# Altium schematic sheet Sheet2_COM.SchDoc
size A3; SheetNumber: 2; SheetTotal: 2
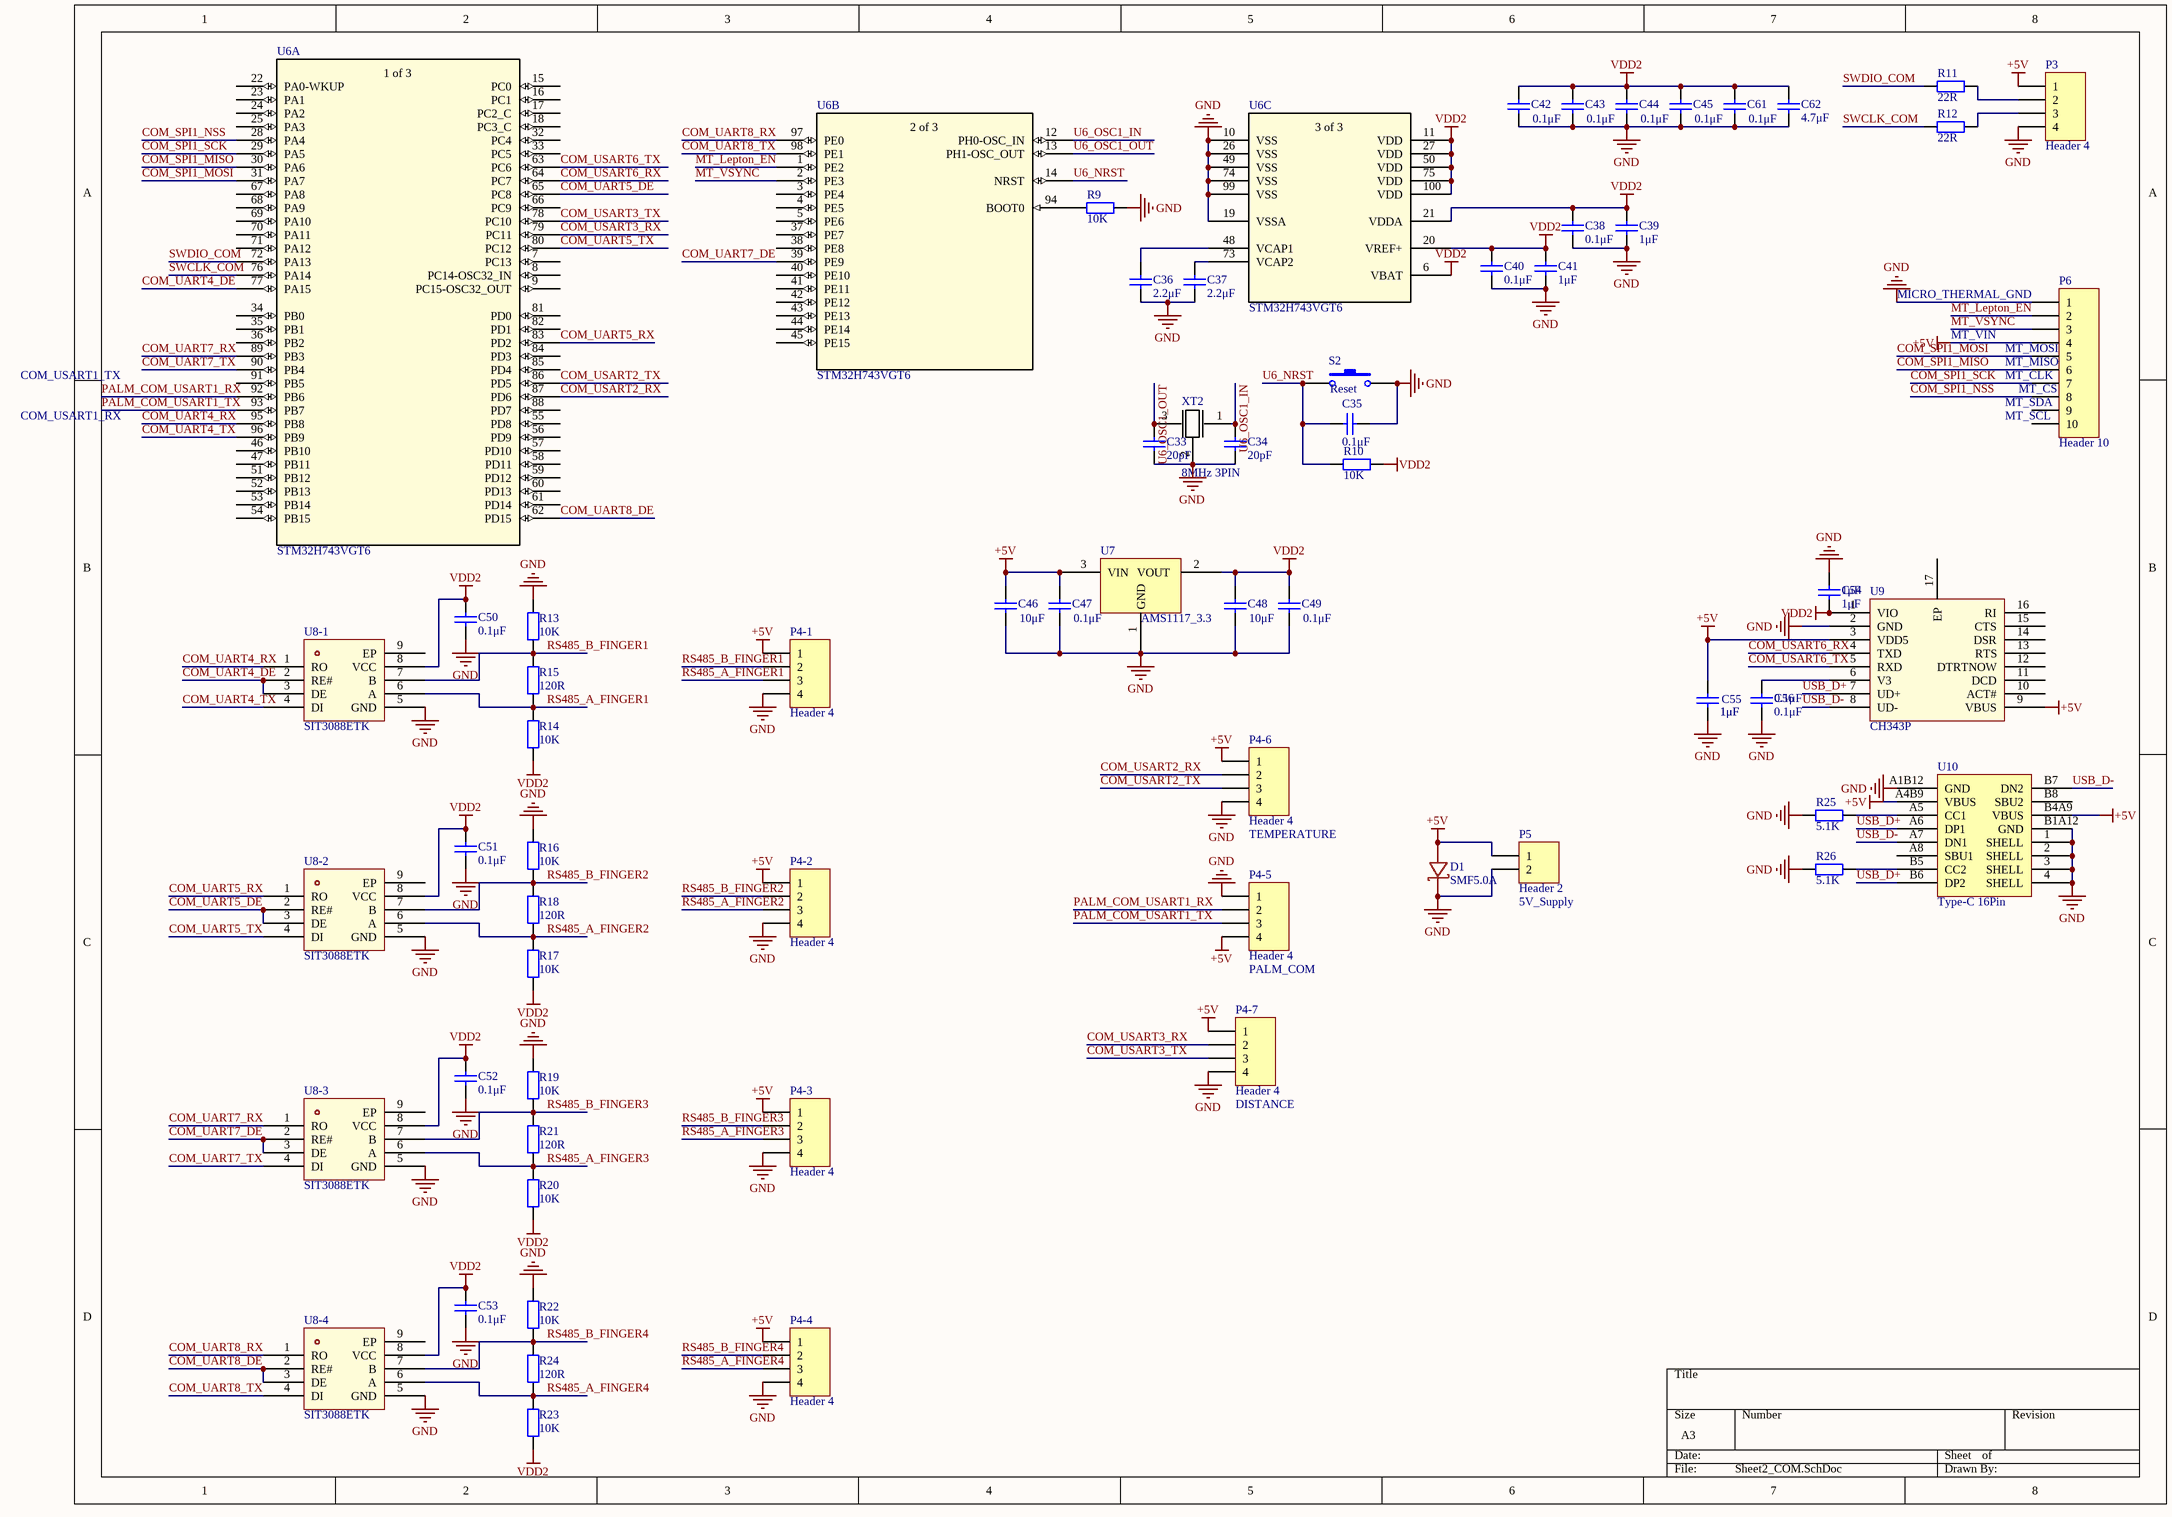
[diagram p0: Sheet2_COM.SchDoc]

## Parts
C33  20pF  [C0402]
C34  20pF  [C0402]
C35  0.1μF  [C0402]
C36  2.2μF  [C0402]
C37  2.2μF  [C0402]
C38  0.1μF  [C0402]
C39  1μF  [C0402]
C40  0.1μF  [C0402]
C41  1μF  [C0402]
C42  0.1μF  [C0402]
C43  0.1μF  [C0402]
C44  0.1μF  [C0402]
C45  0.1μF  [C0402]
C46  10μF  [C0402]
C47  0.1μF  [C0402]
C48  10μF  [C0402]
C49  0.1μF  [C0402]
C50  0.1μF  [C0402]
C51  0.1μF  [C0402]
C52  0.1μF  [C0402]
C53  0.1μF  [C0402]
C54  1μF  [C0402]
C55  1μF  [C0402]
C56  0.1μF  [C0402]
C61  0.1μF  [C0402]
C62  4.7μF  [C0402]
D1  SMF5.0A  [SOD-123FL_L2.7-W1.8-LS3.8-RD]
P3  Header 4  [CONN-SMD_XDWF-0910-04P]
P4-1  Header 4  [CONN-SMD_XDWF-0910-04P]
P4-2  Header 4  [CONN-SMD_XDWF-0910-04P]
P4-3  Header 4  [CONN-SMD_XDWF-0910-04P]
P4-4  Header 4  [CONN-SMD_XDWF-0910-04P]
P4-5  Header 4  [HDR1X4]
P4-6  Header 4  [CONN-SMD_XDWF-0910-04P]
P4-7  Header 4  [CONN-SMD_XDWF-0910-04P]
P5  Header 2  [CONN-SMD_2060-452]
P6  Header 10  [FPC-SMD_10P-P0.50_HCTL_HC-FPC-05-10-10RLTAG]
R9  10K  [R0402]
R10  10K  [R0402]
R11  22R  [R0402]
R12  22R  [R0402]
R13  10K  [R0402]
R14  10K  [R0402]
R15  120R  [R0402]
R16  10K  [R0402]
R17  10K  [R0402]
R18  120R  [R0402]
R19  10K  [R0402]
R20  10K  [R0402]
R21  120R  [R0402]
R22  10K  [R0402]
R23  10K  [R0402]
R24  120R  [R0402]
R25  5.1K  [R0402]
R26  5.1K  [R0402]
S2  Reset  [SW-SMD_L3.9-W3.0-P4.45]
U6  STM32H743VGT6  [LQFP100-14x14mm]  (parts A,B,C of 3)
U7  AMS1117_3.3  [AMS1117-3.3]
U8-1  SIT3088ETK  [DFN-8_L3.0-W3.0-P0.65-BL-EP]
U8-2  SIT3088ETK  [DFN-8_L3.0-W3.0-P0.65-BL-EP]
U8-3  SIT3088ETK  [DFN-8_L3.0-W3.0-P0.65-BL-EP]
U8-4  SIT3088ETK  [DFN-8_L3.0-W3.0-P0.65-BL-EP]
U9  CH343P  [CH343P]
U10  Type-C 16Pin  [USB-C-SMD_TYPE-C16PIN]
XT2  8MHz 3PIN  [8MHz 0.07% OSC-SMD_3P-L3.2-W1.3-P1.20-L]

## Nets
+5V: C46.2 C47.2 C55.2 D1.2(A) P3.1 P4-1.1 P4-2.1 P4-3.1 P4-4.1 P4-5.4 P4-6.1 P4-7.1 P5.1 P6.4 U7.3(VIN) U9.3(VDD5) U9.9(VBUS) U10.A4B9(VBUS) U10.B4A9(VBUS)
GND: C33.1 C34.1 C35.2 C36.1 C37.1 C38.2 C39.2 C40.2 C41.2 C42.1 C43.1 C44.1 C45.1 C46.1 C47.1 C48.1 C49.1 C50.1 C51.1 C52.1 C53.1 C54.1 C55.1 C56.1 C61.1 C62.2 D1.1(K) P3.4 P4-1.4 P4-2.4 P4-3.4 P4-4.4 P4-5.1 P4-6.4 P4-7.4 P5.2 P6.1 R9.1 R13.1 R16.1 R19.1 R22.1 R25.1 R26.1 S2.2 U6.10(VSS) U6.19(VSSA) U6.26(VSS) U6.49(VSS) U6.74(VSS) U6.99(VSS) U7.1(GND) U8-1.5(GND) U8-2.5(GND) U8-3.5(GND) U8-4.5(GND) U9.2(GND) U10.1(SHELL) U10.2(SHELL) U10.3(SHELL) U10.4(SHELL) U10.A1B12(GND) U10.B1A12(GND) XT2.2(GND)
VDD2: C38.1 C39.1 C40.1 C41.1 C42.2 C43.2 C44.2 C45.2 C48.2 C49.2 C50.2 C51.2 C52.2 C53.2 C54.2 C61.2 C62.1 R10.2 R14.2 R17.2 R20.2 R23.2 U6.6(VBAT) U6.11(VDD) U6.20(VREF+) U6.21(VDDA) U6.27(VDD) U6.50(VDD) U6.75(VDD) U6.100(VDD) U7.2(VOUT) U8-1.8(VCC) U8-2.8(VCC) U8-3.8(VCC) U8-4.8(VCC) U9.1(VIO)
COM_SPI1_MISO: P6.6 U6.30(PA6)
COM_SPI1_MOSI: P6.5 U6.31(PA7)
COM_SPI1_NSS: P6.8 U6.28(PA4)
COM_SPI1_SCK: P6.7 U6.29(PA5)
COM_UART4_DE: U6.77(PA15) U8-1.2(RE#) U8-1.3(DE)
COM_UART4_RX: U6.95(PB8) U8-1.1(RO)
COM_UART4_TX: U6.96(PB9) U8-1.4(DI)
COM_UART5_DE: U6.65(PC8) U8-2.2(RE#) U8-2.3(DE)
COM_UART5_RX: U6.83(PD2) U8-2.1(RO)
COM_UART5_TX: U6.80(PC12) U8-2.4(DI)
COM_UART7_DE: U6.39(PE9) U8-3.2(RE#) U8-3.3(DE)
COM_UART7_RX: U6.89(PB3) U8-3.1(RO)
COM_UART7_TX: U6.90(PB4) U8-3.4(DI)
COM_UART8_DE: U6.62(PD15) U8-4.2(RE#) U8-4.3(DE)
COM_UART8_RX: U6.97(PE0) U8-4.1(RO)
COM_UART8_TX: U6.98(PE1) U8-4.4(DI)
COM_USART2_RX: P4-6.2 U6.87(PD6)
COM_USART2_TX: P4-6.3 U6.86(PD5)
COM_USART3_RX: P4-7.2 U6.79(PC11)
COM_USART3_TX: P4-7.3 U6.78(PC10)
COM_USART6_RX: U6.64(PC7) U9.4(TXD)
COM_USART6_TX: U6.63(PC6) U9.5(RXD)
MT_Lepton_EN: P6.2 U6.1(PE2)
MT_VSYNC: P6.3 U6.2(PE3)
PALM_COM_USART1_RX: P4-5.2 U6.92(PB6)
PALM_COM_USART1_TX: P4-5.3 U6.93(PB7)
RS485_A_FINGER1: P4-1.3 R14.1 R15.1 U8-1.6(A)
RS485_A_FINGER2: P4-2.3 R17.1 R18.1 U8-2.6(A)
RS485_A_FINGER3: P4-3.3 R20.1 R21.1 U8-3.6(A)
RS485_A_FINGER4: P4-4.3 R23.1 R24.1 U8-4.6(A)
RS485_B_FINGER1: P4-1.2 R13.2 R15.2 U8-1.7(B)
RS485_B_FINGER2: P4-2.2 R16.2 R18.2 U8-2.7(B)
RS485_B_FINGER3: P4-3.2 R19.2 R21.2 U8-3.7(B)
RS485_B_FINGER4: P4-4.2 R22.2 R24.2 U8-4.7(B)
SWCLK_COM: R12.1 U6.76(PA14)
SWDIO_COM: R11.1 U6.72(PA13)
U6_NRST: C35.1 R10.1 S2.1 U6.14(NRST)
U6_OSC1_IN: C34.2 U6.12(PH0-OSC_IN) XT2.1(OUTPUT)
U6_OSC1_OUT: C33.2 U6.13(PH1-OSC_OUT) XT2.3(INPUT)
USB_D+: U9.7(UD+) U10.A6(DP1) U10.B6(DP2)
USB_D-: U9.8(UD-) U10.A7(DN1) U10.B7(DN2)
NetC36_2: C36.2 U6.48(VCAP1)
NetC37_2: C37.2 U6.73(VCAP2)
NetC56_2: C56.2 U9.6(V3)
NetP3_2: P3.2 R11.2
NetP3_3: P3.3 R12.2
NetR9_2: R9.2 U6.94(BOOT0)
NetR25_2: R25.2 U10.A5(CC1)
NetR26_2: R26.2 U10.B5(CC2)

Not connected (* = marked no-connect by the designer): P6 9 10; U6 3(PE4) 4(PE5) 5(PE6) 7(PC13) 8(PC14-OSC32_IN) 9(PC15-OSC32_OUT) 15(PC0) 16(PC1) 17(PC2_C) 18(PC3_C) 22(PA0-WKUP) 23(PA1) 24(PA2) 25(PA3) 32(PC4) 33(PC5) 34(PB0) 35(PB1) 36(PB2) 37(PE7) 38(PE8) 40(PE10) 41(PE11) 42(PE12) 43(PE13) 44(PE14) 45(PE15) 46(PB10) 47(PB11) 51(PB12) 52(PB13) 53(PB14) 54(PB15) 55(PD8) 56(PD9) 57(PD10) 58(PD11) 59(PD12) 60(PD13) 61(PD14) 66(PC9) 67(PA8) 68(PA9) 69(PA10) 70(PA11) 71(PA12) 81(PD0) 82(PD1) 84(PD3) 85(PD4) 88(PD7) 91(PB5); U8-1 9(EP); U8-2 9(EP); U8-3 9(EP); U8-4 9(EP); U9 10(ACT#) 11(DCD) 12(DTRTNOW) 13(RTS) 14(DSR) 15(CTS) 16(RI) 17(EP); U10 A8(SBU1) B8(SBU2)

## Notes on the sheet
- MICRO_THERMAL_GND
- COM_USART1_TX
- MT_VIN
- (near P6) MT_MOSI
- (near P6) MT_MISO
- (near P6) MT_CLK
- COM_USART1_RX
- (near P6) MT_SDA
- (near P6) MT_SCL
- (near P6) MT_CS
- (near P4-6) TEMPERATURE
- (near P5) 5V_Supply
- (near P4-5) PALM_COM
- (near P4-7) DISTANCE
- (in symbol STM32H743VGT6, part A) 1 of 3
- (in symbol STM32H743VGT6, part B) 2 of 3
- (in symbol STM32H743VGT6, part C) 3 of 3

## Library data of the parts
C33-C56 C61 C62 = Cap Semi: Capacitor (Semiconductor SIM Model); Published: 8-Jun-2000; LatestRevisionDate: 29-May-2009; LatestRevisionNote: IPC-7351 Footprint Added.; PackageReference: C1206; Publisher: Altium Limited; PackageDescription: Chip Capacitor
  C54 C55: Value: 1μF
  C56: Value: 0.1μF
P3 P4-1-P4-4 P4-6 P4-7 = Header 4: XDWF-0910-04P; LatestRevisionDate: 17-Jul-2002; LatestRevisionNote: Re-released for DXP Platform.; Publisher: Altium Limited
P4-5 = Header 4: Header, 4-Pin; LatestRevisionDate: 17-Jul-2002; LatestRevisionNote: Re-released for DXP Platform.; Publisher: Altium Limited
P5 = Header 2: Header, 2-Pin; LatestRevisionDate: 17-Jul-2002; LatestRevisionNote: Re-released for DXP Platform.; Publisher: Altium Limited
P6 = Header 10: Header, 10-Pin; LatestRevisionDate: 17-Jul-2002; LatestRevisionNote: Re-released for DXP Platform.; Publisher: Altium Limited
R9-R26 = Res2: Resistor; Published: 8-Jun-2000; LatestRevisionDate: 17-Jul-2002; LatestRevisionNote: Re-released for DXP Platform.; PackageReference: AXIAL-0.4; Publisher: Altium Limited; PackageDescription: Axial Device, Thru-Hole; 2 Leads; 0.4 in Pin Spacing
S2 = SW-PB: TS-1088R-02026; Published: 24-Mar-1999; LatestRevisionDate: 17-Jul-2002; LatestRevisionNote: Re-released for DXP Platform.; PackageReference: SPST-2; Publisher: Altium Limited; PackageDescription: Switch; 2 Leads
U6 = STM32H743VGT6: No Description Available; Mfr_Name: STMicroelectronics; RefDes: RefDes; Type: Type
U7 = AMS1117_3.3 SOT-89
XT2 = 8MHz 0.07% 3PIN_1: CSTNE8M00GH5C000R0